# EAGLE design motordriver (EAGLE 8.5.0)
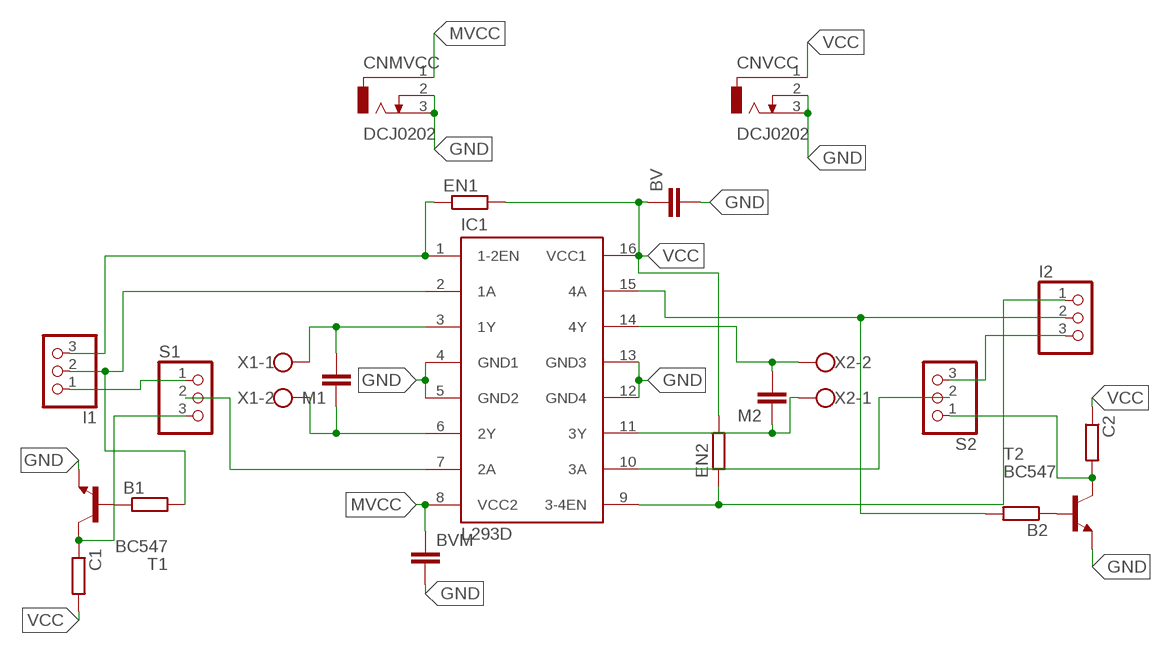
[diagram p0: schematic, sheet 1]

## Parts
B1  R-EU_0204/7  [0204/7]
B2  R-EU_0204/7  [0204/7]
BV  C2.5/2  [C2.5-2]
BVM  C-EU050-025X075  [C050-025X075]
C1  R-EU_0204/7  [0204/7]
C2  R-EU_0204/7  [0204/7]
CNMVCC  DCJ0202  [DCJ0202]
CNVCC  DCJ0202  [DCJ0202]
EN1  R-EU_0204/7  [0204/7]
EN2  R-EU_0204/7  [0204/7]
I1  PINHD-1X3  [1X03]
I2  PINHD-1X3  [1X03]
IC1  L293D  [DIL16]
M1  C2.5/2  [C2.5-2]
M2  C2.5/2  [C2.5-2]
S1  PINHD-1X3  [1X03]
S2  PINHD-1X3  [1X03]
T1  BC547  [TO92]
T2  BC547  [TO92]
X1  W237-102  [W237-102]
X2  W237-102  [W237-102]

## Nets
GND: BV.2 BVM.2 CNMVCC.2 CNMVCC.3 CNVCC.2 CNVCC.3 IC1.4(GND1) IC1.5(GND2) IC1.12(GND4) IC1.13(GND3) T1.1(E) T2.1(E)
MVCC: BVM.1 CNMVCC.1 IC1.8(VCC2)
N$1: EN2.1 I2.1 IC1.9(3-4EN)
N$2: IC1.3(1Y) M1.2 X1.1
N$3: IC1.6(2Y) M1.1 X1.2
N$4: EN1.1 I1.3 IC1.1(1-2EN)
N$5: IC1.14(4Y) M2.2 X2.2
N$6: IC1.11(3Y) M2.1 X2.1
N$7: C1.1 S1.3 T1.3(C)
N$8: I2.3 S2.3
N$9: B1.1 T1.2(B)
N$10: B2.1 T2.2(B)
N$11: I1.1 S1.1
N$12: B1.2 I1.2 IC1.2(1A)
N$13: IC1.7(2A) S1.2
N$15: C2.2 S2.1 T2.3(C)
N$16: IC1.10(3A) S2.2
N$17: B2.2 I2.2 IC1.15(4A)
VCC: BV.1 C1.2 C2.1 CNVCC.1 EN1.2 EN2.2 IC1.16(VCC1)

## Library data of the parts
B1 B2 C1 C2 EN1 EN2 = rcl:R-EU_: RESISTOR, European symbol
BV M1 M2 = capacitor-wima:C: CAPACITOR naming: grid - package width
BVM = rcl:C-EU: CAPACITOR, European symbol
CNMVCC CNVCC = con-jack:DCJ0202: DC POWER JACK Source: DCJ0202.pdf; OC_FARNELL: unknown; OC_NEWARK: unknown
I1 I2 S1 S2 = pinhead:PINHD-1X3: PIN HEADER
IC1 = st-microelectronics:L293D: PUSH-PULL 4 CHANNEL DRIVER; MPN: L293D; OC_FARNELL: 9589619; OC_NEWARK: 56P8249
T1 T2 = transistor:BC547: NPN TRANSISTOR
X1 X2 = con-wago-500:W237-102: WAGO SCREW CLAMP; MPN: 237-102; OC_FARNELL: unknown; OC_NEWARK: 70K9898

## Board
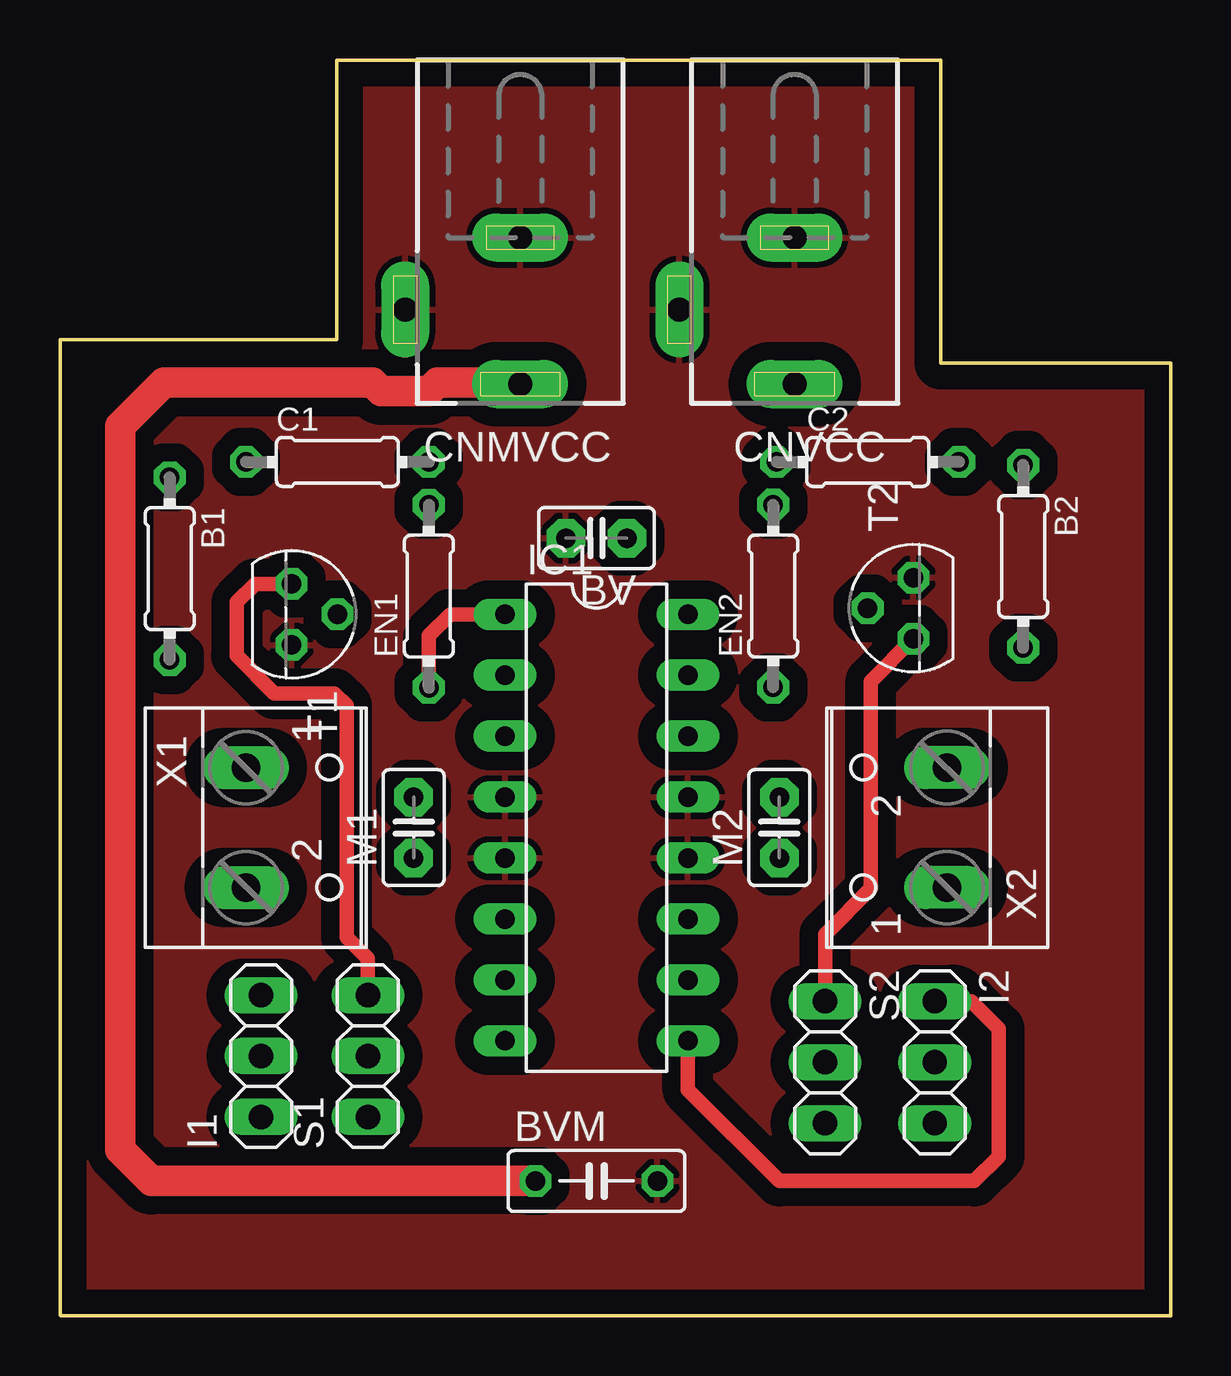
[diagram p1: board, top side]
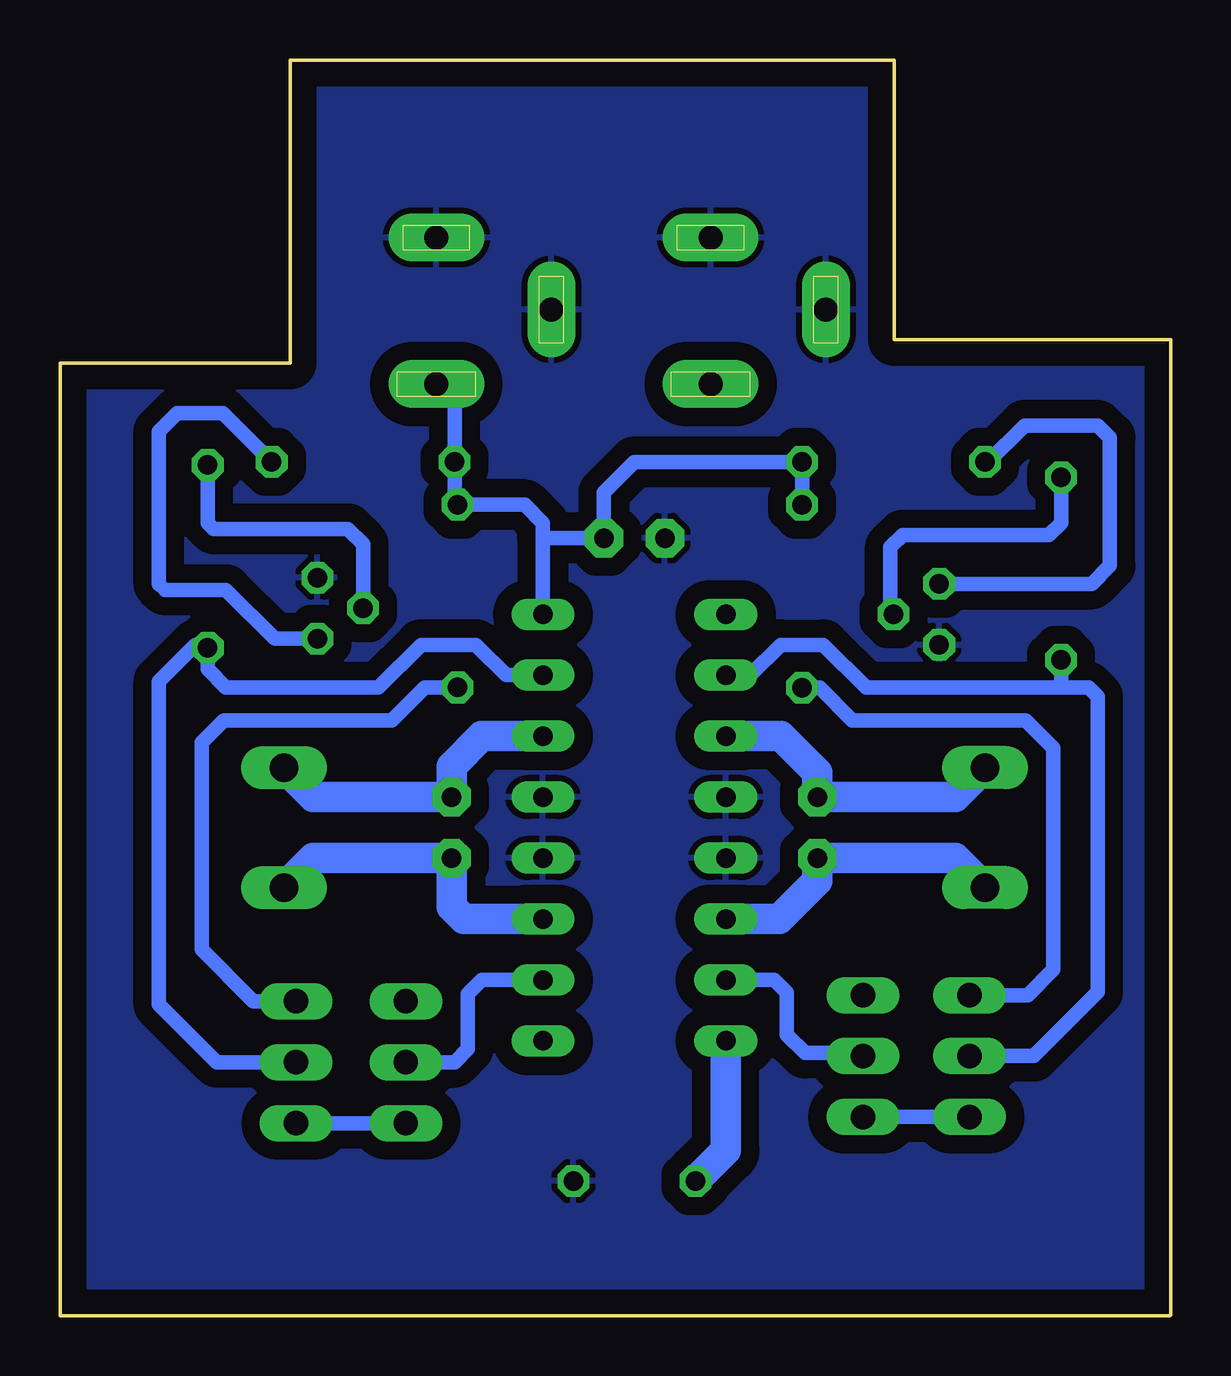
[diagram p2: board, bottom side, seen from below]

Size 46.29 x 52.35 mm. Coordinates in mm from the lower left corner, seen from the top.
Outline: 0.04,0 46.28,0 46.28,39.71 36.7,39.71 36.7,52.35 11.53,52.35 11.53,40.7 0,40.7 0,0.04
Copper layers (1*16): Top 0.035mm / dielectric 1.5mm / Bottom 0.035mm
Design rules "default *": minimum track width 6mil, minimum drill 0.35mm, track to track 30mil, track to pad 30mil, pad to pad 30mil, via to via 30mil, smd to smd 30mil, copper to edge 40mil, drill to drill 6mil, minimum pad ring 10mil, minimum via ring 8mil, stop-mask expansion 4mil, vias tented up to drill 0mil, thermal gap 10mil

### Footprints (pad centres in the part's own frame; a part is rotated, then mirrored left to right if it is on the bottom)
0204/7 = drill 0.813 octagon: 1 -3.81,0; 2 3.81,0
C2.5-2 = drill 0.813 pad 1.6 octagon: 1 -1.27,0; 2 1.27,0
C050-025X075 = drill 0.813 octagon: 1 -2.54,0; 2 2.54,0
DCJ0202 = drill 1 pad 2 long: 1 0,3.1; 2 4.8,0; 3 0,-3
1X03 = drill 1.016 long: 1 -2.54,0; 2 0,0; 3 2.54,0
DIL16 = drill 0.813 long: 1 -8.89,-3.81; 2 -6.35,-3.81; 3 -3.81,-3.81; 4 -1.27,-3.81; 5 1.27,-3.81; 6 3.81,-3.81; 7 6.35,-3.81; 8 8.89,-3.81; 9 8.89,3.81; 10 6.35,3.81; 11 3.81,3.81; 12 1.27,3.81; 13 -1.27,3.81; 14 -3.81,3.81; 15 -6.35,3.81; 16 -8.89,3.81
TO92 = drill 0.813 octagon: 1 1.27,0; 2 0,1.905; 3 -1.27,0
W237-102 = drill 1.194 long: 1 -2.5,-1.27; 2 2.5,-1.27

### Placement (x,y rotation side)
B1  4.57,31.15 270 top
B2  40.13,31.66 270 top
BV  22.35,32.42 180 top
BVM  22.35,5.62 0 top
C1  11.56,35.6 0 top
C2  33.66,35.6 0 top
CNMVCC  19.18,41.95 180 top
CNVCC  30.61,41.95 180 top
EN1  15.37,30 90 top
EN2  29.72,30.01 90 top
I1  8.38,10.83 90 top
I2  36.45,10.58 270 top
IC1  22.35,20.36 270 top
M1  14.73,20.36 90 top
M2  29.97,20.36 90 top
S1  12.83,10.83 90 top
S2  31.88,10.58 270 top
T1  9.65,29.25 270 top
T2  35.56,29.5 90 top
X1  9.02,20.36 270 top
X2  35.69,20.36 90 top

### Tracks (layer width: path | path; a pad name or v marks a point on that pad's centre or on a via)
GND
  pour Bottom: 11.43,52.11 11.43,40.68 0,40.68 0,0.04 46.99,0.04 46.99,39.41 36.83,39.41 36.83,52.11
  pour Top: 0,0.04 0,40.68 11.43,40.68 11.43,52.11 36.83,52.11 36.83,39.41 45.72,39.41 45.72,0.04
MVCC
  Top 1.27: BVM.1 3.81,5.62 2.52,6.92 2.52,37.1 4.32,38.9 13.04,38.9 13.38,38.55 15.37,38.55 15.72,38.9 19.12,38.9 CNMVCC.1
  Bottom 1.27: BVM.1 18.54,6.89 IC1.8
N$1
  Top 0.61: I2.1 37.97,13.12 39.12,11.97 39.12,6.64 38.1,5.62 29.97,5.62 26.16,9.43 IC1.9
  Bottom 0.61: I2.1 38.23,13.12 40.39,15.28 40.39,23.91 39.47,24.83 32.45,24.83 31.08,26.2 EN2.1
N$2
  Bottom 1.27: X1.1 8.98,21.63 M1.2 14.73,22.65 16.25,24.17 IC1.3
N$3
  Bottom 1.27: X1.2 8.98,19.09 M1.1 14.73,18.13 16.31,16.55 IC1.6
N$4
  Top 0.61: EN1.1 15.37,28.36 16.26,29.25 IC1.1
  Bottom 0.61: I1.3 5.97,13.37 4.89,14.45 4.89,23.67 6.05,24.83 13.27,24.83 14.63,26.19 EN1.1
N$5
  Bottom 1.27: X2.2 35.73,21.63 M2.2 29.97,22.9 28.7,24.17 IC1.14
N$6
  Bottom 1.27: X2.1 35.73,19.09 M2.1 29.97,17.05 29.46,16.55 IC1.11
N$7
  Top 0.61: S1.3 12.83,14.9 11.94,15.78 11.94,25.44 11.43,25.94 8.94,25.94 7.36,27.52 7.37,27.52 7.37,29.75 8.13,30.52 T1.3
  Bottom 0.61: T1.3 3.3,30.52 2.54,31.28 2.54,36.61 3.05,37.12 6.1,37.12 7.62,35.6 C1.1
N$8
  Bottom 0.61: S2.3 I2.3
N$9
  Bottom 0.61: T1.2 11.68,29.37 11.68,32.04 11.18,32.55 5.08,32.55 4.57,33.06 B1.1
N$10
  Bottom 0.61: T2.2 33.66,32.17 34.29,32.8 39.88,32.8 40.13,33.06 B2.1
N$11
  Bottom 0.61: I1.1 S1.1
N$12
  Bottom 0.61: IC1.2 17.53,26.71 16.26,27.98 14.48,27.98 12.7,26.2 4.69,26.2 | I1.2 5.71,10.83 3.05,13.5 3.05,25.82 3.43,26.2 4.69,26.2 | B1.2 4.57,26.32 4.69,26.2
N$13
  Bottom 0.61: S1.2 12.95,10.96 15.24,10.96 16,11.72 16,13.49 16.52,14.01 IC1.7
N$15
  Top 0.61: S2.1 31.88,15.91 33.78,17.82 33.78,26.45 T2.3
  Bottom 0.61: T2.3 37.34,28.23 39.37,30.26 41.91,30.26 42.16,30.52 42.16,36.87 41.4,37.63 39.5,37.63 C2.2
N$16
  Bottom 0.61: S2.2 29.84,10.58 29.29,11.14 29.29,13.42 28.7,14.01 IC1.10
N$17
  Bottom 0.61: IC1.15 27.69,26.71 28.96,27.98 31.24,27.98 33.02,26.2 39.37,26.2 40.13,26.96 B2.2 40.26,27.98 40.64,27.98 42.16,26.45 42.16,12.99 39.75,10.58 I2.2
VCC
  Bottom 0.61: 26.16,32.3 IC1.16 | 26.16,32.3 26.16,33.06 26.92,33.82 EN2.2 29.84,33.95 C2.1 29.84,38.08 CNVCC.1 | EN1.2 C1.2 22.35,35.6 23.62,34.33 BV.1 26.04,32.42 26.16,32.3